# EAGLE design Debug FeatherWing (EAGLE 9.6.2)
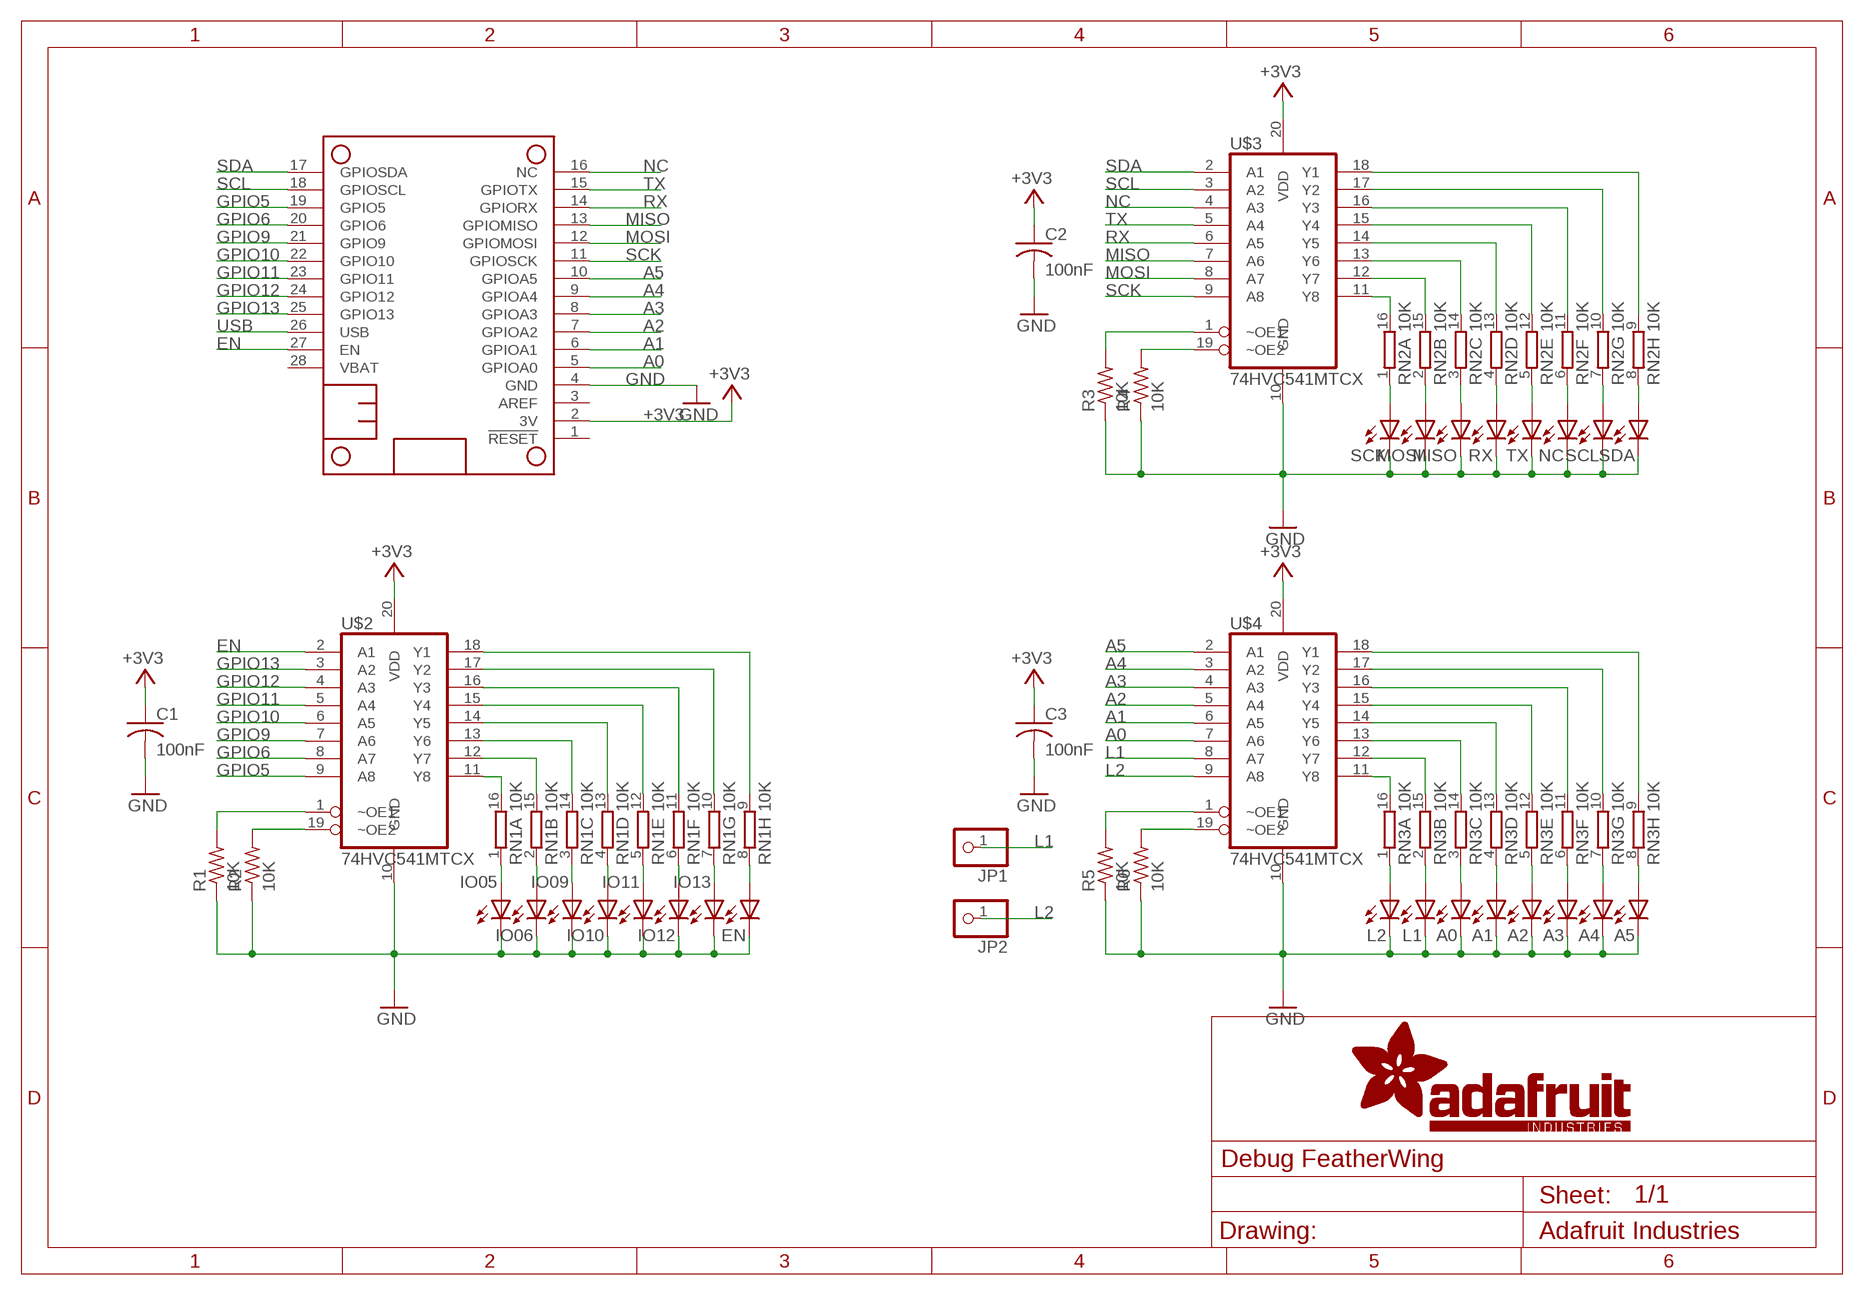
[diagram p0: schematic, sheet 1]

## Parts
A0  Green  LEDCHIPLED_0805  [CHIPLED_0805]
A1  Green  LEDCHIPLED_0805  [CHIPLED_0805]
A2  Green  LEDCHIPLED_0805  [CHIPLED_0805]
A3  Green  LEDCHIPLED_0805  [CHIPLED_0805]
A4  Green  LEDCHIPLED_0805  [CHIPLED_0805]
A5  Green  LEDCHIPLED_0805  [CHIPLED_0805]
C1  100nF  C-USC0805  [C0805]
C2  100nF  C-USC0805  [C0805]
C3  100nF  C-USC0805  [C0805]
EN  Green  LEDCHIPLED_0805  [CHIPLED_0805]
IO05  Green  LEDCHIPLED_0805  [CHIPLED_0805]
IO06  Green  LEDCHIPLED_0805  [CHIPLED_0805]
IO09  Green  LEDCHIPLED_0805  [CHIPLED_0805]
IO10  Green  LEDCHIPLED_0805  [CHIPLED_0805]
IO11  Green  LEDCHIPLED_0805  [CHIPLED_0805]
IO12  Green  LEDCHIPLED_0805  [CHIPLED_0805]
IO13  Green  LEDCHIPLED_0805  [CHIPLED_0805]
JP1  PINHD-1X1  [1X01]
JP2  PINHD-1X1  [1X01]
L1  Green  LEDCHIPLED_0805  [CHIPLED_0805]
L2  Green  LEDCHIPLED_0805  [CHIPLED_0805]
MISO  Green  LEDCHIPLED_0805  [CHIPLED_0805]
MOSI  Green  LEDCHIPLED_0805  [CHIPLED_0805]
MS1  FEATHERWING  [FEATHERWING]
NC  Green  LEDCHIPLED_0805  [CHIPLED_0805]
R1  10K  R-US_R0805  [R0805]
R2  10K  R-US_R0805  [R0805]
R3  10K  R-US_R0805  [R0805]
R4  10K  R-US_R0805  [R0805]
R5  10K  R-US_R0805  [R0805]
R6  10K  R-US_R0805  [R0805]
RN1  10K  8R-NEXB2HV  [EXB2HV]
RN2  10K  8R-NEXB2HV  [EXB2HV]
RN3  10K  8R-NEXB2HV  [EXB2HV]
RX  Green  LEDCHIPLED_0805  [CHIPLED_0805]
SCK  Green  LEDCHIPLED_0805  [CHIPLED_0805]
SCL  Green  LEDCHIPLED_0805  [CHIPLED_0805]
SDA  Green  LEDCHIPLED_0805  [CHIPLED_0805]
TX  Green  LEDCHIPLED_0805  [CHIPLED_0805]
U$2  74HVC541MTCX  [TSSOP20]
U$3  74HVC541MTCX  [TSSOP20]
U$4  74HVC541MTCX  [TSSOP20]

## Nets
+3V3: C1.1 C2.1 C3.1 MS1.2(3V) U$2.20(VDD) U$3.20(VDD) U$4.20(VDD)
A0: MS1.5(GPIOA0) U$4.7(A6)
A1: MS1.6(GPIOA1) U$4.6(A5)
A2: MS1.7(GPIOA2) U$4.5(A4)
A3: MS1.8(GPIOA3) U$4.4(A3)
A4: MS1.9(GPIOA4) U$4.3(A2)
A5: MS1.10(GPIOA5) U$4.2(A1)
EN: MS1.27(EN) U$2.2(A1)
GND: A0.C A1.C A2.C A3.C A4.C A5.C C1.2 C2.2 C3.2 EN.C IO05.C IO06.C IO09.C IO10.C IO11.C IO12.C IO13.C L1.C L2.C MISO.C MOSI.C MS1.4(GND) NC.C R1.1 R2.1 R3.1 R4.1 R5.1 R6.1 RX.C SCK.C SCL.C SDA.C TX.C U$2.10(GND) U$3.10(GND) U$4.10(GND)
GPIO5: MS1.19(GPIO5) U$2.9(A8)
GPIO6: MS1.20(GPIO6) U$2.8(A7)
GPIO9: MS1.21(GPIO9) U$2.7(A6)
GPIO10: MS1.22(GPIO10) U$2.6(A5)
GPIO11: MS1.23(GPIO11) U$2.5(A4)
GPIO12: MS1.24(GPIO12) U$2.4(A3)
GPIO13: MS1.25(GPIO13) U$2.3(A2)
L1: JP1.1 U$4.8(A7)
L2: JP2.1 U$4.9(A8)
MISO: MS1.13(GPIOMISO) U$3.7(A6)
MOSI: MS1.12(GPIOMOSI) U$3.8(A7)
N$1: RN1.9 U$2.18(Y1)
N$2: RN1.10 U$2.17(Y2)
N$3: RN1.11 U$2.16(Y3)
N$4: RN1.12 U$2.15(Y4)
N$5: RN1.13 U$2.14(Y5)
N$6: RN1.14 U$2.13(Y6)
N$7: RN1.15 U$2.12(Y7)
N$8: RN1.16 U$2.11(Y8)
N$9: IO05.A RN1.1
N$10: IO06.A RN1.2
N$11: IO09.A RN1.3
N$12: IO10.A RN1.4
N$13: IO11.A RN1.5
N$14: IO12.A RN1.6
N$15: IO13.A RN1.7
N$16: EN.A RN1.8
N$25: R3.2 U$3.1(~OE1)
N$26: R4.2 U$3.19(~OE2)
N$27: RN2.9 U$3.18(Y1)
N$28: RN2.10 U$3.17(Y2)
N$29: RN2.11 U$3.16(Y3)
N$30: RN2.12 U$3.15(Y4)
N$31: RN2.13 U$3.14(Y5)
N$32: RN2.14 U$3.13(Y6)
N$33: RN2.15 U$3.12(Y7)
N$34: RN2.16 U$3.11(Y8)
N$35: RN2.1 SCK.A
N$36: MOSI.A RN2.2
N$37: MISO.A RN2.3
N$38: RN2.4 RX.A
N$39: RN2.5 TX.A
N$40: NC.A RN2.6
N$41: R1.2 U$2.1(~OE1)
N$42: R2.2 U$2.19(~OE2)
N$43: RN2.7 SCL.A
N$44: RN2.8 SDA.A
N$53: R5.2 U$4.1(~OE1)
N$54: R6.2 U$4.19(~OE2)
N$55: RN3.9 U$4.18(Y1)
N$56: RN3.10 U$4.17(Y2)
N$57: RN3.11 U$4.16(Y3)
N$58: RN3.12 U$4.15(Y4)
N$59: RN3.13 U$4.14(Y5)
N$60: RN3.14 U$4.13(Y6)
N$61: RN3.15 U$4.12(Y7)
N$62: RN3.16 U$4.11(Y8)
N$63: L2.A RN3.1
N$64: L1.A RN3.2
N$65: A0.A RN3.3
N$66: A1.A RN3.4
N$67: A2.A RN3.5
N$68: A3.A RN3.6
N$69: A4.A RN3.7
N$70: A5.A RN3.8
NC: MS1.16(NC) U$3.4(A3)
RX: MS1.14(GPIORX) U$3.6(A5)
SCK: MS1.11(GPIOSCK) U$3.9(A8)
SCL: MS1.18(GPIOSCL) U$3.3(A2)
SDA: MS1.17(GPIOSDA) U$3.2(A1)
TX: MS1.15(GPIOTX) U$3.5(A4)
USB: MS1.26(USB)
Unconnected: MS1.1(!RESET) MS1.3(AREF) MS1.28(VBAT)

## Library data of the parts
A0 A1-A5 EN IO05 IO06 IO09 IO10-IO13 L1 L2 MISO MOSI NC RX SCK SCL SDA TX = adafruit:LED: LED OSRAM: - CHIPLED LG R971, LG N971, LY N971, LG Q971, LY Q971, LO R971, LY R971 LH N974, LH R974 LS Q976, LO Q976, LY Q976 LO Q996 - Hyper CHIPLED LW Q18S LB Q993, LB Q99A, LB R99A - SideLED LS A670, LO A670, LY A670, LG A670, LP A670 LB A673, LV A673, LT A673, LW A673 LH A674 LY A675 LS A676, LA A676, LO A676, LY A676, LW A676 LS A679, LY A679, LG A679 - Hyper Micro SIDELED® LS Y876, LA Y876, LO Y876, LY Y876 LT Y87S - SmartLED LW L88C, LW L88S LB L89C, LB L89S, LG L890 LS L89K, LO L89K, LY L89K LS L896, LA L896, LO L896, LY L896 - TOPLED LS T670, LO T670, LY T670, LG T670, LP T670 LSG T670, LSP T670, LSY T670, LOP T670, LYG T670 LG T671, LOG T671, LSG T671 LB T673, LV T673, LT T673, LW T673 LH T674 LS T676, LA T676, LO T676, LY T676, LB T676, LH T676, LSB T676, LW T676 LB T67C, LV T67C, LT T67C, LS T67K, LO T67K, LY T67K, LW E67C LS E67B, LA E67B, LO E67B, LY E67B, LB E67C, LV E67C, LT E67C LW T67C LS T679, LY T679, LG T679 LS T770, LO T770, LY T770, LG T770, LP T770 LB T773, LV T773, LT T773, LW T773 LH T774 LS E675, LA E675, LY E675, LS T675 LS T776, LA T776, LO T776, LY T776, LB T776 LHGB T686 LT T68C, LB T68C - Hyper Mini TOPLED® LB M676 - Mini TOPLED Santana® LG M470 LS M47K, LO M47K, LY M47K Source: http://www.osram.convergy.de/
C1-C3 = rcl:C-US: CAPACITOR, American symbol; DIELECTRIC: X7R; SPICEPREFIX: C
JP1 JP2 = adafruit:PINHD-1X1: Pin header 1x1 for 0.1" spacing With round pins
MS1 = microbuilder:FEATHERWING
R1-R6 = rcl:R-US_: RESISTOR, American symbol; SPICEPREFIX: R
RN1-RN3 = resistor-dil:8R-N: DIL RESISTOR; OC_FARNELL: unknown; OC_NEWARK: unknown
U$2-U$4 = Custom Parts:74HVC541MTCX

## Board
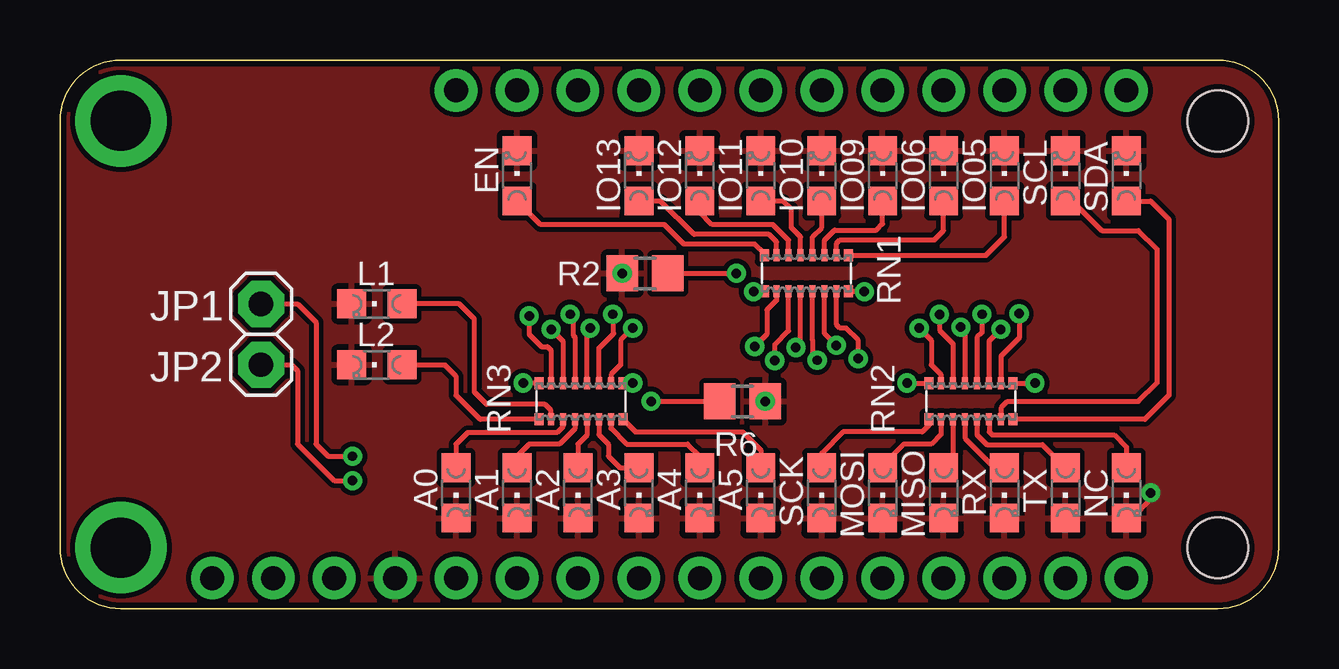
[diagram p1: board, top side]
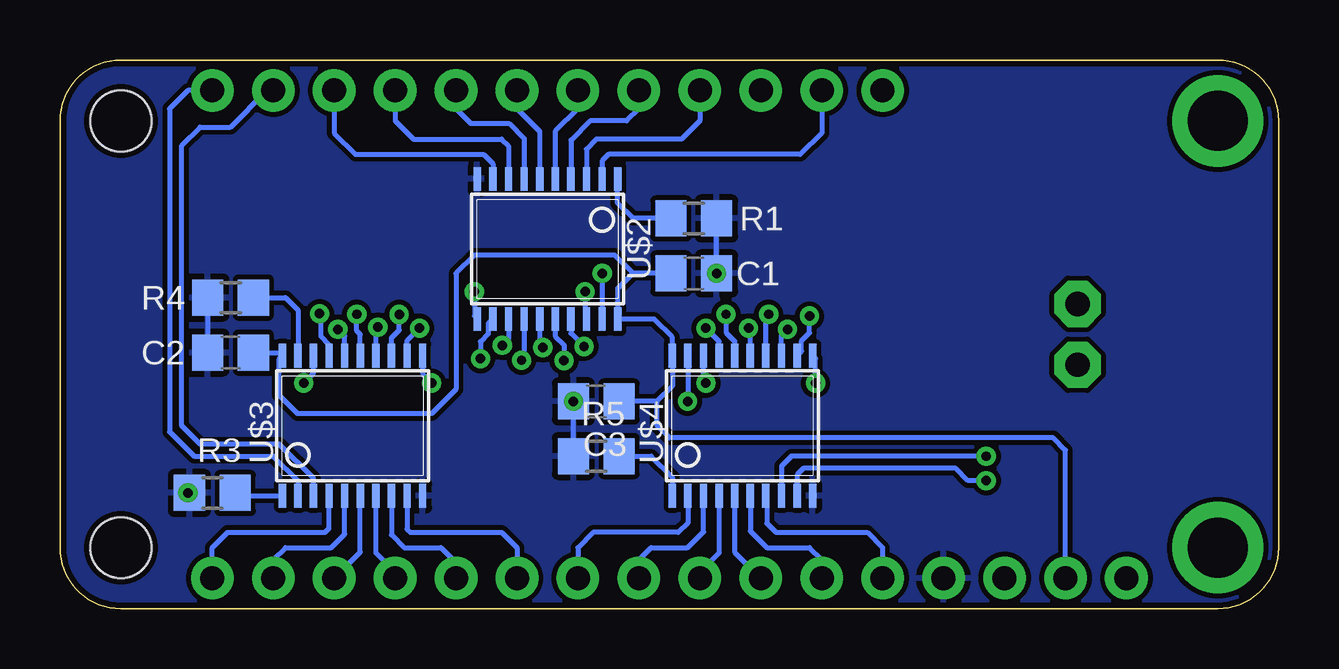
[diagram p2: board, bottom side, seen from below]

Size 50.8 x 22.86 mm. Coordinates in mm from the lower left corner, seen from the top.
Outline: 2.54,22.86 48.26,22.86 arc-90 50.8,20.32 50.8,2.54 arc-90 48.26,0 2.54,0 arc-90 0,2.54 0,20.32 arc-90 2.54,22.86
Copper layers (1*16): Top 0.035mm / dielectric 1.5mm / Bottom 0.035mm
Design rules "adafruit": minimum track width 8mil, minimum drill 15.5mil, track to track 8mil, track to pad 8mil, pad to pad 8mil, via to via 8mil, smd to smd 8mil, copper to edge 10mil, drill to drill 8mil, minimum pad ring 10mil, minimum via ring 8mil, stop-mask expansion 2mil, vias tented up to drill 20mil, thermal gap 10mil

### Footprints (pad centres in the part's own frame; a part is rotated, then mirrored left to right if it is on the bottom)
CHIPLED_0805 = smd 1.2 x 1.2: A 0,-1.05; C 0,1.05
C0805 = smd 1.3 x 1.5: 1 -0.95,0; 2 0.95,0
1X01 = drill 1.016 pad 1.93 octagon: 1 0,0
FEATHERWING = drill 1 pad 1.778: 1 6.35,1.27; 2 8.89,1.27; 3 11.43,1.27; 4 13.97,1.27; 5 16.51,1.27; 6 19.05,1.27; 7 21.59,1.27; 8 24.13,1.27; 9 26.67,1.27; 10 29.21,1.27; 11 31.75,1.27; 12 34.29,1.27; 13 36.83,1.27; 14 39.37,1.27; 15 41.91,1.27; 16 44.45,1.27; 17 44.45,21.59; 18 41.91,21.59; 19 39.37,21.59; 20 36.83,21.59; 21 34.29,21.59; 22 31.75,21.59; 23 29.21,21.59; 24 26.67,21.59; 25 24.13,21.59; 26 21.59,21.59; 27 19.05,21.59; 28 16.51,21.59 | drill 2.5 pad 3.81: P$1 2.54,20.32; P$2 2.54,2.54 | hole 2.54: 48.26,20.32; 48.26,2.54
R0805 = smd 1.3 x 1.5: 1 -0.95,0; 2 0.95,0
EXB2HV = smd 0.38 x 0.5: 1 -1.75,-0.75; 8 1.75,-0.75; 9 1.75,0.75; 16 -1.75,0.75 | smd 0.25 x 0.5: 2 -1.25,-0.75; 3 -0.75,-0.75; 4 -0.25,-0.75; 5 0.25,-0.75; 6 0.75,-0.75; 7 1.25,-0.75; 10 1.25,0.75; 11 0.75,0.75; 12 0.25,0.75; 13 -0.25,0.75; 14 -0.75,0.75; 15 -1.25,0.75
TSSOP20 = smd 0.305 x 0.991: 1 -2.925,-2.918; 2 -2.275,-2.918; 3 -1.625,-2.918; 4 -0.975,-2.918; 5 -0.325,-2.918; 6 0.325,-2.918; 7 0.975,-2.918; 8 1.625,-2.918; 9 2.275,-2.918; 10 2.925,-2.918; 11 2.925,2.918; 12 2.275,2.918; 13 1.625,2.918; 14 0.975,2.918; 15 0.325,2.918; 16 -0.325,2.918; 17 -0.975,2.918; 18 -1.625,2.918; 19 -2.275,2.918; 20 -2.925,2.918

### Placement (x,y rotation side)
A0  16.51,4.83 180 top
A1  19.05,4.83 180 top
A2  21.59,4.83 180 top
A3  24.13,4.83 180 top
A4  26.67,4.83 180 top
A5  29.21,4.83 180 top
C1  24.38,13.97 0 bottom
C2  43.69,10.67 180 bottom
C3  28.45,8.64 180 bottom
EN  19.05,18.03 0 top
IO05  39.37,18.03 0 top
IO06  36.83,18.03 0 top
IO09  34.29,18.03 0 top
IO10  31.75,18.03 0 top
IO11  29.21,18.03 0 top
IO12  26.67,18.03 0 top
IO13  24.13,18.03 0 top
JP1  8.38,12.7 0 top
JP2  8.38,10.16 0 top
L1  13.21,12.7 90 top
L2  13.21,10.16 90 top
MISO  36.83,4.83 180 top
MOSI  34.29,4.83 180 top
MS1  0,0 0 top
NC  44.45,4.83 180 top
R1  24.38,16.26 180 bottom
R2  24.38,13.97 0 top
R3  44.45,4.83 0 bottom
R4  43.69,12.95 0 bottom
R5  28.45,6.35 0 bottom
R6  28.45,8.64 180 top
RN1  31.11,13.97 180 top
RN2  37.97,8.64 0 top
RN3  21.72,8.64 0 top
RX  39.37,4.83 180 top
SCK  31.75,4.83 180 top
SCL  41.91,18.03 0 top
SDA  44.45,18.03 0 top
TX  41.91,4.83 180 top
U$2  30.48,14.99 180 bottom
U$3  38.61,7.62 0 bottom
U$4  22.35,7.62 0 bottom

### Tracks (layer width: path | path; a pad name or v marks a point on that pad's centre or on a via)
+3V3
  Bottom 0.203: C1.1 26.92,13.97 | 26.92,13.97 27.55,13.34 U$2.20 26.04,12.07 25.28,11.31 U$4.20 25.28,9.27 25.91,8.64 | 25.91,8.64 C3.1 | C2.1 41.66,10.67 U$3.20 41.66,10.41 41.66,8.89 40.89,8.13 35.31,8.13 34.29,9.14 34.29,13.97 33.53,14.73 27.69,14.73 26.92,13.97 | MS1.2 8.89,6.6 9.4,7.11 25.4,7.11 25.91,7.62 25.91,8.64
A0
  Bottom 0.203: U$4.7 21.34,4.66 21.34,3.56 20.95,3.17 17.14,3.17 16.51,2.54 MS1.5
A1
  Bottom 0.203: U$4.6 22.03,3.23 21.34,2.54 19.56,2.54 19.05,2.03 MS1.6
A2
  Bottom 0.203: U$4.5 22.68,2.36 MS1.7
A3
  Bottom 0.203: U$4.4 23.33,2.33 24.13,1.52 MS1.8
A4
  Bottom 0.203: MS1.9 26.67,2.03 26.16,2.54 24.64,2.54 23.98,3.2 U$4.3
A5
  Bottom 0.203: U$4.2 24.63,3.57 25.02,3.17 28.57,3.17 29.21,2.54 MS1.10
EN
  Bottom 0.203: MS1.27 19.05,19.81 19.94,18.92 27.94,18.92 28.2,18.66 U$2.2
GND  (via drill 0.39)
  Top 0.203: v45.47,4.83 45.47,4.57 44.67,3.78 NC.C
  Bottom 0.203: R2.1 R1.1 | R5.1 C3.2 | R4.1 C2.2 | R3.1 v45.47,4.83
  other vias: 23.43,13.97 29.4,8.64
  pour Top: 2.54,22.86 48.26,22.86 arc-90 50.8,20.32 50.8,2.54 arc-90 48.26,0 2.54,0 arc-90 0,2.54 0,20.32 arc-90
  pour Bottom: 2.54,22.86 48.26,22.86 arc-90 50.8,20.32 50.8,2.54 arc-90 48.26,0 2.54,0 arc-90 0,2.54 0,20.32 arc-90
GPIO5
  Bottom 0.203: MS1.19 39.37,19.81 38.48,18.92 33.15,18.92 32.76,18.53 U$2.9
GPIO6
  Bottom 0.203: MS1.20 36.83,20.32 36.07,19.56 32.38,19.56 32.1,19.28 U$2.8
GPIO9
  Bottom 0.203: MS1.21 34.29,20.83 33.68,20.22 32.09,20.22 31.45,19.58 U$2.7
GPIO10
  Bottom 0.203: MS1.22 31.75,20.83 30.8,19.88 U$2.6
GPIO11
  Bottom 0.203: MS1.23 29.21,20.83 30.16,19.88 U$2.5
GPIO12
  Bottom 0.203: MS1.24 26.67,20.83 27.18,20.32 28.7,20.32 29.5,19.52 U$2.4
GPIO13
  Bottom 0.203: 24.13,20.83 MS1.25 24.13,20.32 24.89,19.56 28.45,19.56 28.86,19.15 U$2.3
L1  (via drill 0.39)
  Top 0.203: JP1.1 9.91,12.7 10.67,11.94 10.67,6.86 11.18,6.35 v12.19,6.35
  Bottom 0.203: U$4.8 20.73,5.94 20.32,6.35 v12.19,6.35
L2  (via drill 0.39)
  Top 0.203: JP2.1 9.65,10.16 9.91,9.91 9.91,6.86 11.43,5.33 v12.19,5.33
  Bottom 0.203: v12.19,5.33 12.95,5.33 13.46,5.84 19.81,5.84 20.08,5.58 U$4.9
MISO
  Bottom 0.203: U$3.7 37.63,2.33 36.83,1.52 MS1.13
MOSI
  Bottom 0.203: U$3.8 36.98,3.07 36.45,2.54 34.92,2.54 34.29,1.91 MS1.12
N$1  (via drill 0.39)
  Top 0.203: RN1.9 28.92,13.22 v28.91,13.21
  Bottom 0.203: v28.91,13.21 28.91,12.12 U$2.18
N$2  (via drill 0.39)
  Top 0.203: v28.96,10.92 29.46,11.43 29.46,12.45 29.86,12.85 RN1.10
  Bottom 0.203: v28.96,10.92 29.5,11.47 U$2.17
N$3  (via drill 0.39)
  Top 0.203: v29.79,10.34 29.79,11 30.36,11.57 RN1.11
  Bottom 0.203: U$2.16 30.16,11.36 29.79,11 v29.79,10.34
N$4  (via drill 0.39)
  Top 0.203: v30.67,10.88 30.86,11.07 RN1.12
  Bottom 0.203: U$2.15 30.8,11.01 v30.67,10.88
N$5  (via drill 0.39)
  Top 0.203: RN1.13 31.36,11.18 31.38,11.17 31.38,10.53 v31.56,10.35
  Bottom 0.203: U$2.14 31.45,10.46 v31.56,10.35
N$6  (via drill 0.39)
  Top 0.203: v32.36,10.97 31.86,11.46 RN1.14
  Bottom 0.203: U$2.13 32.1,11.22 v32.36,10.97
N$7  (via drill 0.39)
  Top 0.203: v33.27,10.41 33.27,11.18 32.77,11.68 32.51,11.68 32.37,11.83 RN1.15
  Bottom 0.203: U$2.12 32.95,11.88 32.95,11.45 33.27,11.12 v33.27,10.41
N$8  (via drill 0.39)
  Top 0.203: RN1.16 33.52,13.22 v33.53,13.21
  Bottom 0.203: 33.37,12.04 U$2.11 33.53,12.19 v33.53,13.21
N$9
  Top 0.203: RN1.1 38.6,14.72 39.37,15.49 IO05.A
N$10
  Top 0.203: RN1.2 32.37,15.22 32.51,15.37 36.45,15.37 36.83,15.75 IO06.A
N$11
  Top 0.203: RN1.3 31.86,15.36 32.28,15.77 34.04,15.77 34.29,16.03 IO09.A
N$12
  Top 0.203: RN1.4 31.36,15.49 31.75,15.88 IO10.A
N$13
  Top 0.203: RN1.5 30.86,15.49 30.48,15.88 30.48,16.64 30.13,16.98 IO11.A
N$14
  Top 0.203: RN1.6 30.36,15.36 29.72,16 27.18,16 26.67,16.51 IO12.A
N$15
  Top 0.203: RN1.7 29.86,15.28 29.55,15.6 26.43,15.6 25.04,16.98 IO13.A
N$16
  Top 0.203: RN1.8 29.36,14.78 28.96,15.19 26,15.19 25.19,16 20.03,16 EN.A
N$25
  Bottom 0.203: R3.2 43.38,4.7 U$3.1
N$26
  Bottom 0.203: U$3.19 40.88,12.44 41.4,12.95 R4.2
N$27  (via drill 0.39)
  Top 0.203: RN2.9 40.63,9.39 v40.64,9.4
  Bottom 0.203: v40.64,9.4 40.23,9.8 U$3.18
N$28  (via drill 0.39)
  Top 0.203: v39.98,12.29 39.98,11.28 39.22,10.52 RN2.10
  Bottom 0.203: U$3.17 39.58,11.01 39.92,11.34 39.92,12.24 v39.98,12.29
N$29  (via drill 0.39)
  Top 0.203: v39.22,11.64 38.72,11.14 RN2.11
  Bottom 0.203: U$3.16 38.93,11.35 v39.22,11.64
N$30  (via drill 0.39)
  Top 0.203: v38.43,12.27 38.43,11.5 38.22,11.3 RN2.12
  Bottom 0.203: U$3.15 38.28,11.43 38.43,11.57 v38.43,12.27
N$31  (via drill 0.39)
  Top 0.203: v37.55,11.73 37.72,11.55 RN2.13
  Bottom 0.203: U$3.14 37.63,11.64 v37.55,11.73
N$32  (via drill 0.39)
  Top 0.203: v36.66,12.26 36.66,11.6 37.22,11.04 RN2.14
  Bottom 0.203: U$3.13 36.98,11.28 36.66,11.6 v36.66,12.26
N$33  (via drill 0.39)
  Top 0.203: v35.81,11.68 36.32,11.18 36.32,10.16 36.72,9.76 RN2.15
  Bottom 0.203: U$3.12 36.32,11.18 v35.81,11.68
N$34  (via drill 0.39)
  Top 0.203: v35.31,9.4 RN2.16
  Bottom 0.203: U$3.11 35.68,9.78 v35.31,9.4
N$35
  Top 0.203: RN2.1 36.22,7.65 35.94,7.37 32.64,7.37 31.75,6.48 SCK.A
N$36
  Top 0.203: RN2.2 36.72,7.26 36.32,6.86 35.18,6.86 34.29,5.97 MOSI.A
N$37
  Top 0.203: RN2.3 37.22,6.27 MISO.A
N$38
  Top 0.203: RN2.4 37.72,7.11 38.95,5.88 RX.A
N$39
  Top 0.203: RN2.5 38.23,7.24 38.63,6.83 40.95,6.83 TX.A
N$40
  Top 0.203: RN2.6 38.73,7.87 38.73,7.37 38.86,7.24 43.94,7.24 44.45,6.73 NC.A
N$41
  Bottom 0.203: U$2.1 27.55,16.89 26.92,16.26 R1.2
N$42  (via drill 0.39)
  Top 0.203: R2.2 v28.19,13.97
  Bottom 0.203: v28.19,13.97 28.2,13.96 U$2.19
N$43
  Top 0.203: 41.91,17.02 SCL.A 42.2,16.98 43.43,15.75 44.96,15.75 45.72,14.99 45.72,9.4 44.96,8.64 39.5,8.64 39.24,8.38 39.24,8.02 39.23,8.01 RN2.7
N$44
  Top 0.203: SDA.A 45.47,16.98 46.23,16.22 46.23,8.89 45.22,7.89 RN2.8
N$53
  Bottom 0.203: R5.2 26.16,6.35 25.28,5.46 U$4.1
N$54  (via drill 0.39)
  Top 0.203: v24.64,8.64 R6.2
  Bottom 0.203: U$4.19 24.63,8.65 v24.64,8.64
N$55  (via drill 0.39)
  Top 0.203: RN3.9 v23.88,9.4
  Bottom 0.203: v23.88,9.4 23.98,9.5 U$4.18
N$56  (via drill 0.39)
  Top 0.203: v23.88,11.68 23.37,11.18 23.37,10.16 22.97,9.76 RN3.10
  Bottom 0.203: U$4.17 23.33,11.13 v23.88,11.68
N$57  (via drill 0.39)
  Top 0.203: RN3.11 22.47,10.85 23.08,11.46 23.08,12.22 v23.04,12.27
  Bottom 0.203: v23.04,12.27 23.04,11.5 22.68,11.14 U$4.16
N$58  (via drill 0.39)
  Top 0.203: RN3.12 21.97,11.55 v22.1,11.68
  Bottom 0.203: U$4.15 22.03,11.61 v22.1,11.68
N$59  (via drill 0.39)
  Top 0.203: RN3.13 21.47,11.32 21.39,11.39 21.39,12.13 v21.26,12.27
  Bottom 0.203: U$4.14 21.38,12.15 v21.26,12.27
N$60  (via drill 0.39)
  Top 0.203: v20.47,11.64 20.97,11.14 RN3.14
  Bottom 0.203: U$4.13 20.73,11.38 v20.47,11.64
N$61  (via drill 0.39)
  Top 0.203: v19.56,12.19 19.56,11.43 20.07,10.92 20.32,10.92 20.47,10.78 RN3.15
  Bottom 0.203: U$4.12 19.88,10.73 19.88,11.16 19.56,11.49 v19.56,12.19
N$62  (via drill 0.39)
  Top 0.203: RN3.16 19.32,9.39 v19.3,9.4
  Bottom 0.203: 19.46,10.57 U$4.11 19.3,10.41 v19.3,9.4
N$63
  Top 0.203: RN3.1 17.51,7.89 16.51,8.89 16.51,9.69 16.04,10.16 L2.A
N$64
  Top 0.203: RN3.2 20.46,8.26 20.21,8.51 17.78,8.51 17.27,9.02 17.27,12.06 16.64,12.7 L1.A
N$65
  Top 0.203: RN3.3 20.97,7.58 20.72,7.33 16.98,7.33 16.51,6.86 A0.A
N$66
  Top 0.203: RN3.4 21.47,7.5 20.82,6.86 19.56,6.86 19.05,6.35 A1.A
N$67
  Top 0.203: RN3.5 21.97,7.24 21.59,6.86 A2.A
N$68
  Top 0.203: RN3.6 22.47,7.25 22.86,6.86 22.86,6.35 23.33,5.88 A3.A
N$69
  Top 0.203: RN3.7 22.97,7.51 23.62,6.86 26.16,6.86 26.67,6.35 A4.A
N$70
  Top 0.203: RN3.8 23.99,7.37 28.45,7.37 29.21,6.6 A5.A
NC
  Bottom 0.203: MS1.16 44.45,2.54 43.81,3.17 39.75,3.17 39.58,3.34 U$3.4
RX
  Bottom 0.203: U$3.6 38.28,2.36 MS1.14
SCK
  Bottom 0.203: U$3.9 36.33,3.31 36.2,3.17 32.38,3.17 31.75,2.54 MS1.11
SCL
  Bottom 0.203: U$3.3 40.23,5.43 41.66,6.86 44.96,6.86 45.72,7.62 45.72,19.3 44.96,20.07 43.69,20.07 42.16,21.59 MS1.18
SDA
  Bottom 0.203: MS1.17 45.47,21.59 46.23,20.83 46.23,7.37 45.21,6.35 41.91,6.35 40.88,5.32 U$3.2
TX
  Bottom 0.203: MS1.15 41.91,2.03 41.4,2.54 39.5,2.54 38.93,3.1 U$3.5